# EAGLE schematic audioAmp (EAGLE 8.7.1)

## Sheet 1 of 2
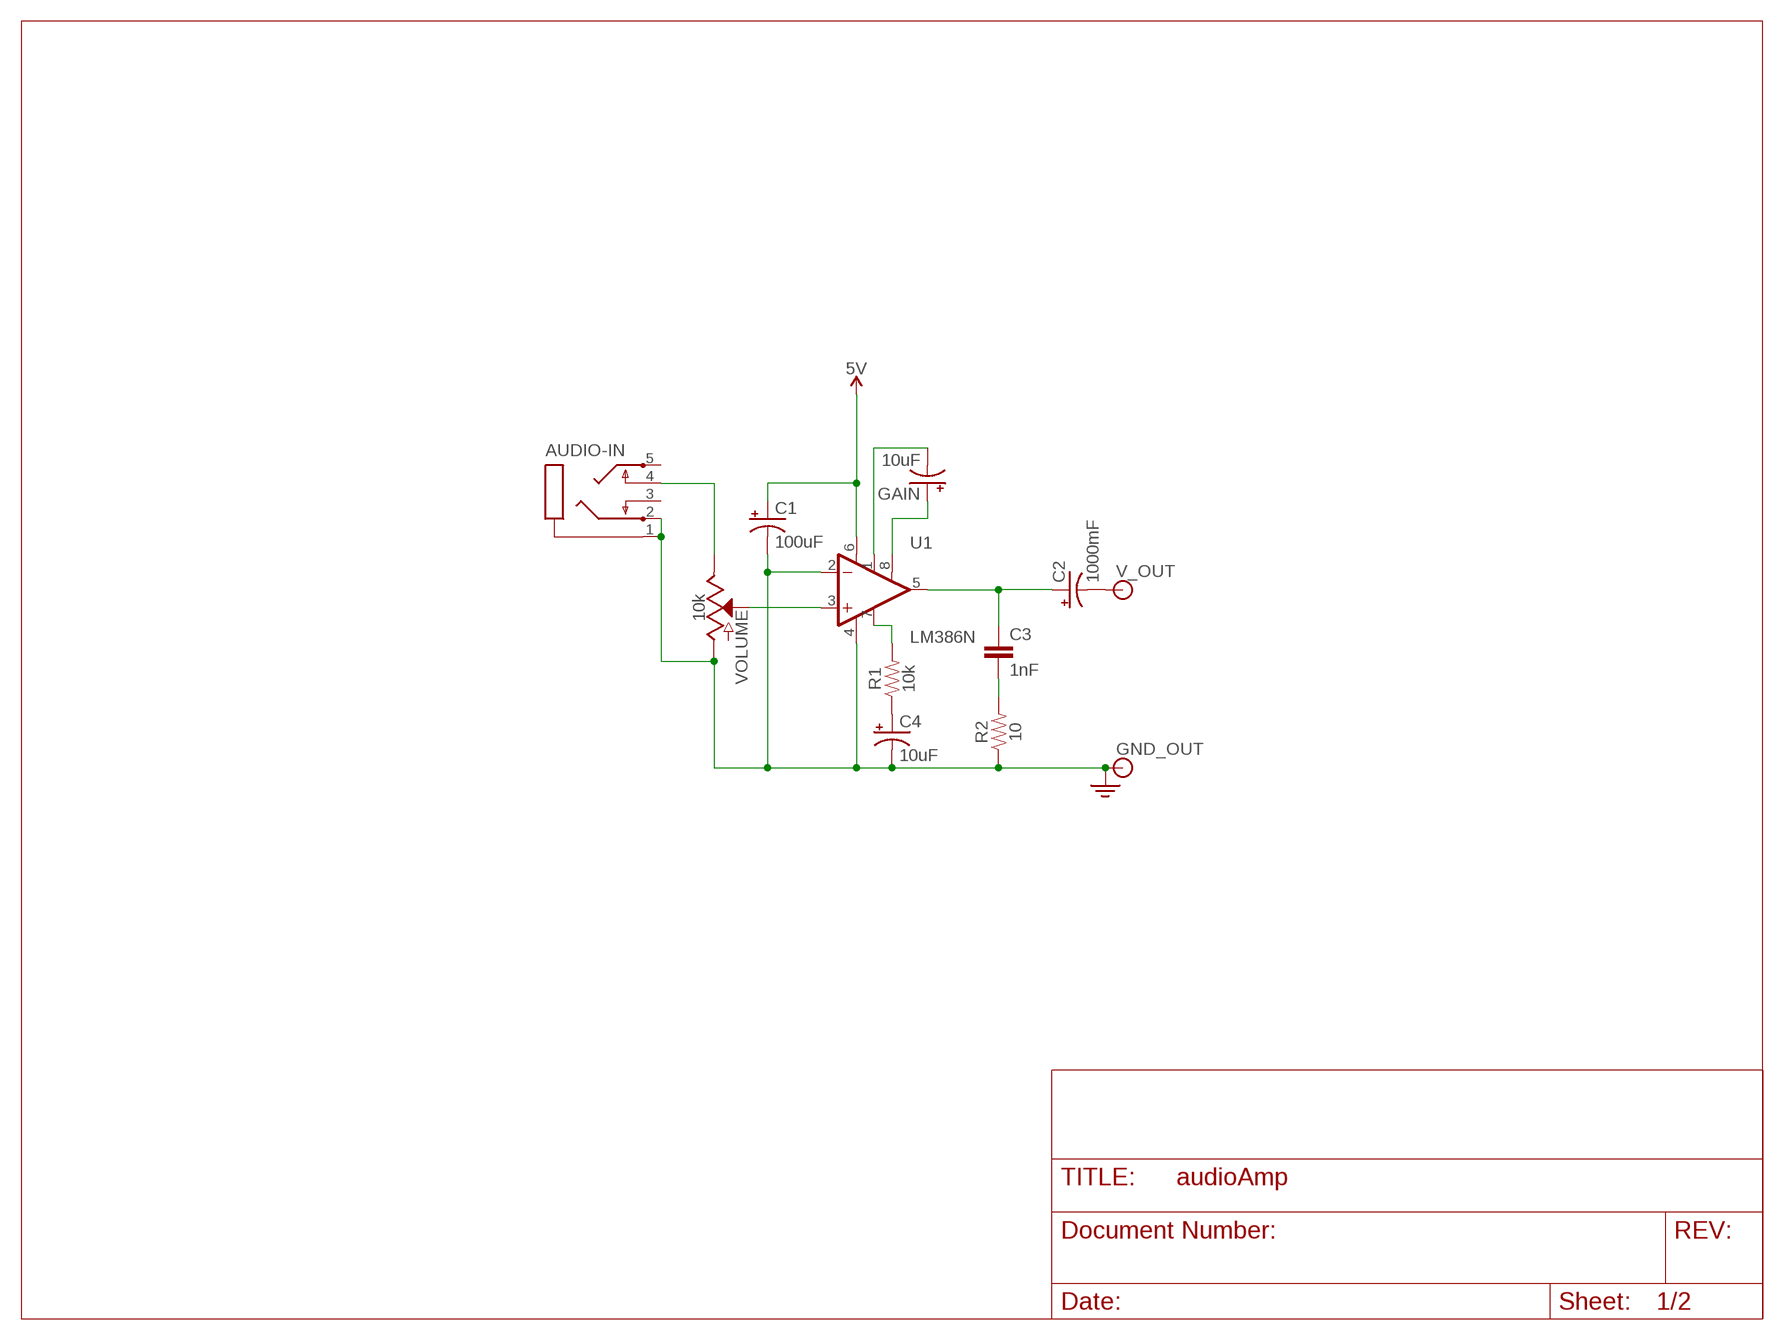
[diagram p0: schematic, sheet 1]

### Parts
AUDIO-IN  STEREOJACK  [STX3100]
C1  100uF  100UF-POLAR-RADIAL-2.5MM-25V-20%  [CPOL-RADIAL-2.5MM-6.5MM]
C2  1000mF  1000UF-RADIAL-5MM-25V-20%  [CPOL-RADIAL-5MM-10MM]
C3  1nF  1.0NF/1000PF-0603-50V-10%  [0603]
C4  10uF  10UF-POLAR-RADIAL-2.5MM-25V-20%  [CPOL-RADIAL-2.5MM-5MM]
GAIN  10uF  10UF-POLAR-RADIAL-2.5MM-25V-20%  [CPOL-RADIAL-2.5MM-5MM]
GND_OUT  BANANA_CONN  [BANANA_CONN]
R1  10k  10KOHM-HORIZ-1/4W-1%  [AXIAL-0.3]
R2  10  10OHM-HORIZ-1/4W-1%  [AXIAL-0.3]
U1  LM386N  LM386  [DIP08]
V_OUT  BANANA_CONN  [BANANA_CONN]
VOLUME  10k  POTENTIOMETER-PTH-9MM-1/20W-20%  [POT-PTH-ALPS]

### Nets
3.3V: AUDIO-IN.1 AUDIO-IN.2 C1.2(-) C4.2(-) GND_OUT.P$1 R2.P$1 U1.2(-IN) U1.4(V-) VOLUME.P$3(A)
5V: C1.1(+) U1.6(V+)
N$1: GAIN.2(-) U1.1(GAIN)
N$2: GAIN.1(+) U1.8(GAIN)
N$3: R1.P$2 U1.7(BP)
N$4: C4.1(+) R1.P$1
N$5: C3.2 R2.P$2
N$6: C2.+ C3.1 U1.5(OUT)
N$7: U1.3(+IN) VOLUME.P$2(S)
N$8: C2.- V_OUT.P$1
N$9: AUDIO-IN.4 VOLUME.P$1(E)
Unconnected: AUDIO-IN.3 AUDIO-IN.5

## Sheet 2 of 2
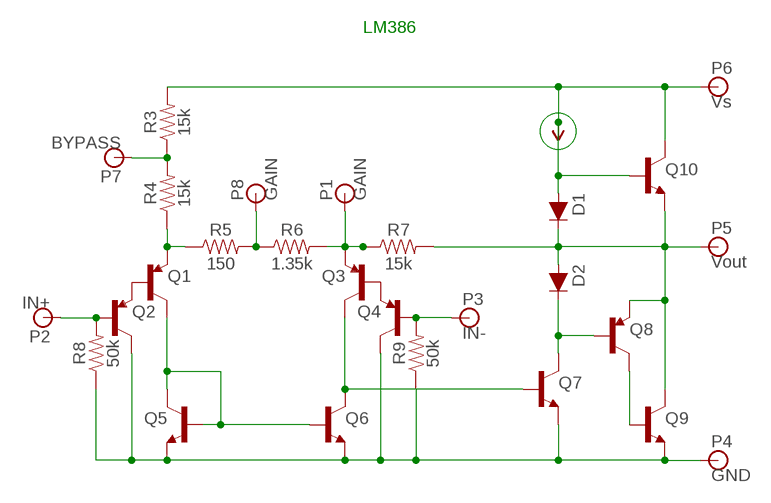
[diagram p1: schematic, sheet 2]

### Parts
D1  DIODE-1N4148  [DIODE-1N4148]
D2  DIODE-1N4148  [DIODE-1N4148]
P1  GAIN  BANANA_CONN  [BANANA_CONN]
P2  IN+  BANANA_CONN  [BANANA_CONN]
P3  IN-  BANANA_CONN  [BANANA_CONN]
P4  GND  BANANA_CONN  [BANANA_CONN]
P5  Vout  BANANA_CONN  [BANANA_CONN]
P6  Vs  BANANA_CONN  [BANANA_CONN]
P7  BYPASS  BANANA_CONN  [BANANA_CONN]
P8  GAIN  BANANA_CONN  [BANANA_CONN]
Q1  TRANS_PNP-MMBT4403  [SOT23-3]
Q2  TRANS_PNP-MMBT4403  [SOT23-3]
Q3  TRANS_PNP-MMBT4403  [SOT23-3]
Q4  TRANS_PNP-MMBT4403  [SOT23-3]
Q5  TRANS_NPN-MMBT2222AL  [SOT23-3]
Q6  TRANS_NPN-MMBT2222AL  [SOT23-3]
Q7  TRANS_NPN-MMBT2222AL  [SOT23-3]
Q8  TRANS_PNP-MMBT4403  [SOT23-3]
Q9  TRANS_NPN-MMBT2222AL  [SOT23-3]
Q10  TRANS_NPN-MMBT2222AL  [SOT23-3]
R3  15k  15KOHM-HORIZ-1/4W-5%  [AXIAL-0.3]
R4  15k  15KOHM-HORIZ-1/4W-5%  [AXIAL-0.3]
R5  150  RESISTORAXIAL-0.3  [AXIAL-0.3]
R6  1.35k  RESISTORAXIAL-0.3  [AXIAL-0.3]
R7  15k  RESISTORAXIAL-0.3  [AXIAL-0.3]
R8  50k  RESISTORAXIAL-0.3  [AXIAL-0.3]
R9  50k  RESISTORAXIAL-0.3  [AXIAL-0.3]

### Nets
N$10: P7.P$1 R3.P$1 R4.P$2
N$11: Q1.2(E) R4.P$1 R5.P$1
N$12: Q1.1(B) Q2.2(E)
N$13: P8.P$1 R5.P$2 R6.P$1
N$14: P2.P$1 Q2.1(B) R8.P$2
N$15: P1.P$1 Q3.2(E) R6.P$2 R7.P$1
N$16: Q3.1(B) Q4.2(E)
N$17: P3.P$1 Q4.1(B) R9.P$2
N$18: Q1.3(C) Q5.1(B) Q5.3(C) Q6.1(B)
N$19: Q3.3(C) Q6.3(C) Q7.1(B)
N$21: D1.C D2.A P5.P$1 Q8.2(E) Q9.3(C) Q10.2(E) R7.P$2
N$22: P4.P$1 Q2.3(C) Q4.3(C) Q5.2(E) Q6.2(E) Q7.2(E) Q9.2(E) R8.P$1 R9.P$1
N$23: D2.C Q7.3(C) Q8.1(B)
N$25: Q8.3(C) Q9.1(B)
VNEG: D1.A P6.P$1 Q10.1(B) Q10.3(C) R3.P$2

### Notes on the sheet
- LM386

## Library data of the parts
AUDIO-IN = adafruit:STEREOJACK: MIC/HEADPHONE JACK Stereo jack with two switches. Kycon STX3100, CUI SJ1-3555NG and/or 4UCon 05544
C1 = SparkFun-Capacitors:100UF-POLAR: 100µF polarized capacitors A capacitor is a passive two-terminal electrical component used to store electrical energy temporarily in an electric field.; PROD_ID: CAP-08439
C2 = SparkFun-Capacitors:1000UF: 1,000µF/1mF ceramic capacitors A capacitor is a passive two-terminal electrical component used to store electrical energy temporarily in an electric field. CAP-08070; PROD_ID: CAP-09538; VALUE: 1mF
C3 = SparkFun-Capacitors:1.0NF/1000PF: 1nF/1,000pF ceramic capacitors A capacitor is a passive two-terminal electrical component used to store electrical energy temporarily in an electric field.; PROD_ID: CAP-07886
C4 GAIN = SparkFun-Capacitors:10UF-POLAR: 10.0µF polarized capacitors A capacitor is a passive two-terminal electrical component used to store electrical energy temporarily in an electric field.; PROD_ID: CAP-08440
D1 D2 = SparkFun-DiscreteSemi:DIODE: Diode These are standard reverse protection diodes and small signal diodes. SparkFun Products: SparkFun SparkPunk Sound Kit <https://www.sparkfun.com/products/11177> SparkFun ESP8266 Thing <https://www.sparkfun.com/products/13231>; PROD_ID: DIO-08378; VALUE: 200mA/100V/1V
GND_OUT P1-P8 V_OUT = SparkFun-Connectors:BANANA_CONN: Through-hole Banana Jack Basic PTH connection for banana jack plugs SparkFun Products: Multimeter Kit <https://www.sparkfun.com/products/retired/10956> Banana to Alligator Cable <https://www.sparkfun.com/products/retired/509> Banana to Alligator Coax Cable <https://www.sparkfun.com/products/retired/508> Banana to Banana Cable <https://www.sparkfun.com/products/retired/507> Banana to IC Hook Cables <https://www.sparkfun.com/products/retired/506>
Q1-Q4 Q8 = SparkFun-DiscreteSemi:TRANS_PNP: PNP transistor Current controlled devices typically used to amplify current or used as a switch. SparkFun Products: SparkFun Serial Enabled 16x2 LCD - Red on Black <https://www.sparkfun.com/products/9068> SparkFun Logomatic <https://www.sparkfun.com/products/12772>; PROD_ID: TRANS-09245; VALUE: 600mA/40V
Q5-Q7 Q9 Q10 = SparkFun-DiscreteSemi:TRANS_NPN: NPN transistor Current controlled devices typically used to amplify current or used as a switch. BC547 - COM-08928 <http://www.sparkfun.com/products/8928> (TO-92 45V 100mA) (1.Collector 2.Base 3.Emitter) 2N3904 - COM-00521 <http://www.sparkfun.com/products/521> (TO-92 40V 200mA) (1.Emitter 2.Base 3.Collector) P2N2222A - COM-12852 <http://www.sparkfun.com/products/12852> (TO-92 40V 600mA) (1.Collector 2.Base 3.Emitter); PROD_ID: TRANS-08049; VALUE: 600mA/40V
R1 = SparkFun-Resistors:10KOHM: 10kΩ resistor A resistor is a passive two-terminal electrical component that implements electrical resistance as a circuit element. Resistors act to reduce current flow, and, at the same time, act to lower voltage levels within circuits. - Wikipedia; PROD_ID: RES-12183
R2 = SparkFun-Resistors:10OHM: 10Ω resistor A resistor is a passive two-terminal electrical component that implements electrical resistance as a circuit element. Resistors act to reduce current flow, and, at the same time, act to lower voltage levels within circuits. - Wikipedia; PROD_ID: RES-12180
R3 R4 = SparkFun-Resistors:15KOHM: 15kΩ resistor A resistor is a passive two-terminal electrical component that implements electrical resistance as a circuit element. Resistors act to reduce current flow, and, at the same time, act to lower voltage levels within circuits. - Wikipedia; PROD_ID: RES-11360
R5-R9 = SparkFun-Resistors:RESISTOR: Generic Resistor Package
U1 = SparkFun-IC-Amplifiers:LM386: low voltage audio power amplifier SparkFun Products FabFM Radio Kit <https://www.sparkfun.com/products/11043> (KIT-11043); PROD_ID: IC-10899
VOLUME = SparkFun-Resistors:POTENTIOMETER: Potentiometer (Pot) Three-terminal potentiometers, with an adjustable wiper and two adjustable resistors. A pot can be used to create a configurable voltage divider, or as a variable resistor. Variants ALPS_POT and ALPS_POT_KIT - PTH, breadboard compatible, 9mm square pots Rotary Potentiometer - Linear (10k ohm) <https://www.sparkfun.com/products/9288> (COM-09288) The KIT variant exposes copper on only one side of the PTH pad, so the part can only be assembled on one side of the PCB. Useful for beginner soldering kits.; PROD_ID: RES-09177; SF_SKU: COM-09288